# Altium schematic sheet WS2812_MATRIX_1.SchDoc
size A4
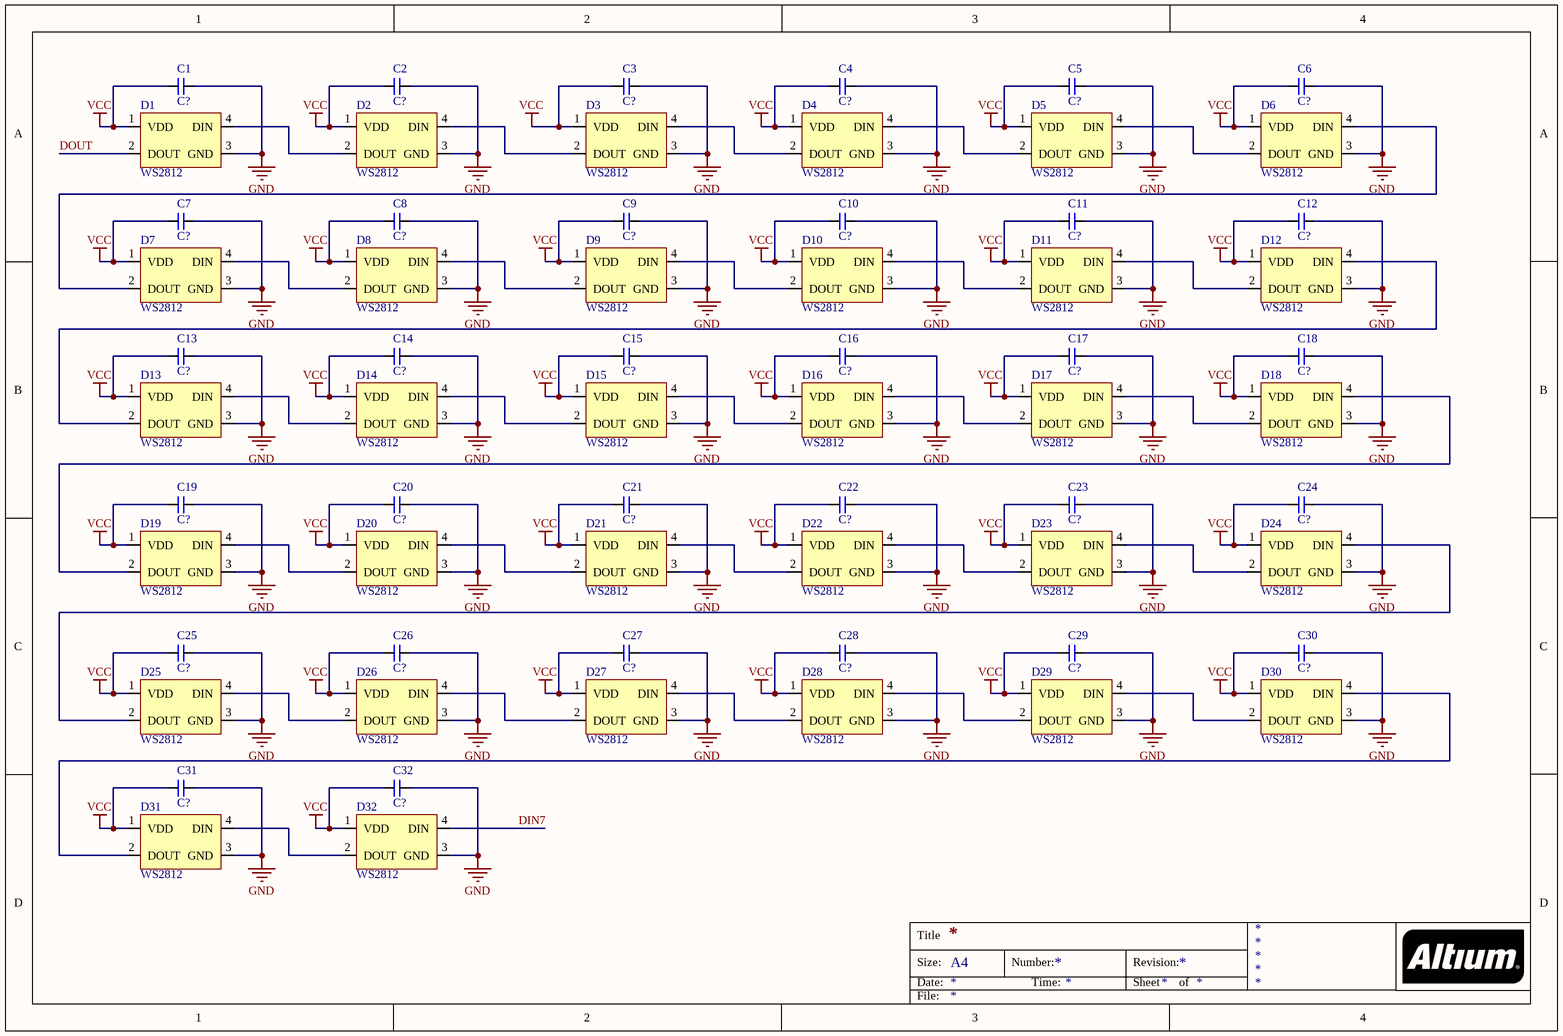
[diagram p0: WS2812_MATRIX_1.SchDoc]

## Parts
C1  C?  [C0603]
C2  C?  [C0603]
C3  C?  [C0603]
C4  C?  [C0603]
C5  C?  [C0603]
C6  C?  [C0603]
C7  C?  [C0603]
C8  C?  [C0603]
C9  C?  [C0603]
C10  C?  [C0603]
C11  C?  [C0603]
C12  C?  [C0603]
C13  C?  [C0603]
C14  C?  [C0603]
C15  C?  [C0603]
C16  C?  [C0603]
C17  C?  [C0603]
C18  C?  [C0603]
C19  C?  [C0603]
C20  C?  [C0603]
C21  C?  [C0603]
C22  C?  [C0603]
C23  C?  [C0603]
C24  C?  [C0603]
C25  C?  [C0603]
C26  C?  [C0603]
C27  C?  [C0603]
C28  C?  [C0603]
C29  C?  [C0603]
C30  C?  [C0603]
C31  C?  [C0603]
C32  C?  [C0603]
D1  WS2812  [WS2812_3528]
D2  WS2812  [WS2812_3528]
D3  WS2812  [WS2812_3528]
D4  WS2812  [WS2812_3528]
D5  WS2812  [WS2812_3528]
D6  WS2812  [WS2812_3528]
D7  WS2812  [WS2812_3528]
D8  WS2812  [WS2812_3528]
D9  WS2812  [WS2812_3528]
D10  WS2812  [WS2812_3528]
D11  WS2812  [WS2812_3528]
D12  WS2812  [WS2812_3528]
D13  WS2812  [WS2812_3528]
D14  WS2812  [WS2812_3528]
D15  WS2812  [WS2812_3528]
D16  WS2812  [WS2812_3528]
D17  WS2812  [WS2812_3528]
D18  WS2812  [WS2812_3528]
D19  WS2812  [WS2812_3528]
D20  WS2812  [WS2812_3528]
D21  WS2812  [WS2812_3528]
D22  WS2812  [WS2812_3528]
D23  WS2812  [WS2812_3528]
D24  WS2812  [WS2812_3528]
D25  WS2812  [WS2812_3528]
D26  WS2812  [WS2812_3528]
D27  WS2812  [WS2812_3528]
D28  WS2812  [WS2812_3528]
D29  WS2812  [WS2812_3528]
D30  WS2812  [WS2812_3528]
D31  WS2812  [WS2812_3528]
D32  WS2812  [WS2812_3528]

## Nets
GND: C1.2 C2.2 C3.2 C4.2 C5.2 C6.2 C7.2 C8.2 C9.2 C10.2 C11.2 C12.2 C13.2 C14.2 C15.2 C16.2 C17.2 C18.2 C19.2 C20.2 C21.2 C22.2 C23.2 C24.2 C25.2 C26.2 C27.2 C28.2 C29.2 C30.2 C31.2 C32.2 D1.3(GND) D2.3(GND) D3.3(GND) D4.3(GND) D5.3(GND) D6.3(GND) D7.3(GND) D8.3(GND) D9.3(GND) D10.3(GND) D11.3(GND) D12.3(GND) D13.3(GND) D14.3(GND) D15.3(GND) D16.3(GND) D17.3(GND) D18.3(GND) D19.3(GND) D20.3(GND) D21.3(GND) D22.3(GND) D23.3(GND) D24.3(GND) D25.3(GND) D26.3(GND) D27.3(GND) D28.3(GND) D29.3(GND) D30.3(GND) D31.3(GND) D32.3(GND)
VCC: C1.1 C2.1 C3.1 C4.1 C5.1 C6.1 C7.1 C8.1 C9.1 C10.1 C11.1 C12.1 C13.1 C14.1 C15.1 C16.1 C17.1 C18.1 C19.1 C20.1 C21.1 C22.1 C23.1 C24.1 C25.1 C26.1 C27.1 C28.1 C29.1 C30.1 C31.1 C32.1 D1.1(VDD) D2.1(VDD) D3.1(VDD) D4.1(VDD) D5.1(VDD) D6.1(VDD) D7.1(VDD) D8.1(VDD) D9.1(VDD) D10.1(VDD) D11.1(VDD) D12.1(VDD) D13.1(VDD) D14.1(VDD) D15.1(VDD) D16.1(VDD) D17.1(VDD) D18.1(VDD) D19.1(VDD) D20.1(VDD) D21.1(VDD) D22.1(VDD) D23.1(VDD) D24.1(VDD) D25.1(VDD) D26.1(VDD) D27.1(VDD) D28.1(VDD) D29.1(VDD) D30.1(VDD) D31.1(VDD) D32.1(VDD)
DIN7: D32.4(DIN)
DOUT: D1.2(DOUT)
NetD1_4: D1.4(DIN) D2.2(DOUT)
NetD2_4: D2.4(DIN) D3.2(DOUT)
NetD3_4: D3.4(DIN) D4.2(DOUT)
NetD4_4: D4.4(DIN) D5.2(DOUT)
NetD5_4: D5.4(DIN) D6.2(DOUT)
NetD6_4: D6.4(DIN) D7.2(DOUT)
NetD7_4: D7.4(DIN) D8.2(DOUT)
NetD8_4: D8.4(DIN) D9.2(DOUT)
NetD9_4: D9.4(DIN) D10.2(DOUT)
NetD10_4: D10.4(DIN) D11.2(DOUT)
NetD11_4: D11.4(DIN) D12.2(DOUT)
NetD12_4: D12.4(DIN) D13.2(DOUT)
NetD13_4: D13.4(DIN) D14.2(DOUT)
NetD14_4: D14.4(DIN) D15.2(DOUT)
NetD15_4: D15.4(DIN) D16.2(DOUT)
NetD16_4: D16.4(DIN) D17.2(DOUT)
NetD17_4: D17.4(DIN) D18.2(DOUT)
NetD18_4: D18.4(DIN) D19.2(DOUT)
NetD19_4: D19.4(DIN) D20.2(DOUT)
NetD20_4: D20.4(DIN) D21.2(DOUT)
NetD21_4: D21.4(DIN) D22.2(DOUT)
NetD22_4: D22.4(DIN) D23.2(DOUT)
NetD23_4: D23.4(DIN) D24.2(DOUT)
NetD24_4: D24.4(DIN) D25.2(DOUT)
NetD25_4: D25.4(DIN) D26.2(DOUT)
NetD26_4: D26.4(DIN) D27.2(DOUT)
NetD27_4: D27.4(DIN) D28.2(DOUT)
NetD28_4: D28.4(DIN) D29.2(DOUT)
NetD29_4: D29.4(DIN) D30.2(DOUT)
NetD30_4: D30.4(DIN) D31.2(DOUT)
NetD31_4: D31.4(DIN) D32.2(DOUT)

## Notes on the sheet
- Title
- Size:
- Date:
- A4
- Number:
- Time:
- Revision:
- Sheet
- of
- File:

## Library data of the parts
C1-C32 = CAP